# Altium schematic sheet AnalogSensors.SchDoc
size A4
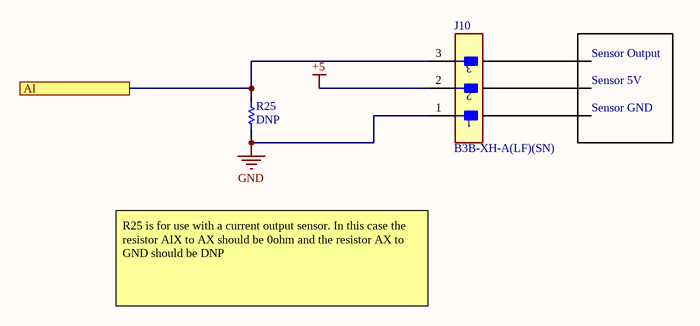
[diagram p0: AnalogSensors.SchDoc]

## Parts
J10  B3B-XH-A(LF)(SN)  [FP-B3B-XH-A_LF_SN-MFG]
R25  DNP  [RESC0603(1608)_L]

## Ports
AI

## Nets
+5: J10.2
GND: J10.1 R25.2
AI: J10.3 R25.1 ; port AI

## Notes on the sheet
- Sensor Output
- Sensor 5V
- Sensor GND
- R25 is for use with a current output sensor. In this case the resistor AIX to AX should be 0ohm and the resistor AX to GND should be DNP

## Library data of the parts
J10 = CMP-17439-000014-1: CONN HEADER VERT 3POS 2.5MM; Manufacturer: JST; Conn Gender: Male; Conn Orientation: Vertical; Voltage Rating: 250V; Number Of Contacts: 3; Current Rating: 3A; Contact Material: Tin,Copper; Temperature Range Low: -25°C; Octopart: https://octopart.com/b3b-xh-a%28lf%29%28sn%29-jst-3990185; Device Class L3: unset; Device Class L1: Connectors; Lead Free: Yes; Temperature: -25°C to +85°C; Manufacturer Part Number: B3B-XH-A(LF)(SN); Package: 0; ComponentLink2Description: Datasheet; Pitch: 2.5mm; RoHS: TRUE; Category: Conn; Automotive: No; Temperature Range High: +85°C; Height: 7mm; Device Class L2: Headers and Wire Housings; Number Of Rows: 1; Digikey Description: CONN HEADER VERT 3POS 2.5MM; ComponentLink2URL: https://www.jst-mfg.com/product/pdf/eng/eXH.pdf
R25 = CMP-1012-00440-1: 249R 0.1W 1% 0603 (1608 Metric)  SMD; Value: 249.00 Ohm; Case-Metric: 1608; Case-EIA: 0603; Technology: SMT; Tolerance: 1 %; Power: 0.1 W